# Altium schematic sheet Overview_sch.SchDoc
size A4; SheetNumber: 1; SheetTotal: 6
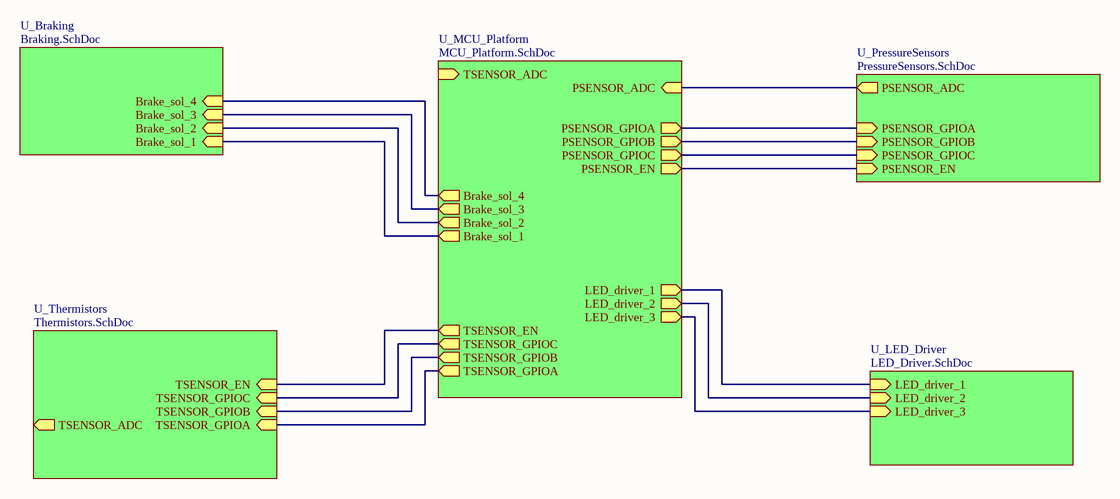
[diagram p0: Overview_sch.SchDoc]

## Sub-sheets
U_Braking = Braking.SchDoc: Brake_sol_1 (in), Brake_sol_2 (in), Brake_sol_3 (in), Brake_sol_4 (in)
U_LED_Driver = LED_Driver.SchDoc: LED_driver_1 (in), LED_driver_2 (in), LED_driver_3 (in)
U_MCU_Platform = MCU_Platform.SchDoc: TSENSOR_GPIOA (out), TSENSOR_GPIOB (out), TSENSOR_GPIOC (out), TSENSOR_EN (out), TSENSOR_ADC (in), PSENSOR_GPIOA (out), PSENSOR_GPIOB (out), PSENSOR_GPIOC (out), PSENSOR_EN (out), PSENSOR_ADC (in), LED_driver_1 (out), LED_driver_2 (out), LED_driver_3 (out), Brake_sol_1 (out), Brake_sol_2 (out), Brake_sol_3 (out), Brake_sol_4 (out)
U_PressureSensors = PressureSensors.SchDoc: PSENSOR_GPIOA (in), PSENSOR_GPIOB (in), PSENSOR_GPIOC (in), PSENSOR_EN (in), PSENSOR_ADC (out)
U_Thermistors = Thermistors.SchDoc: TSENSOR_GPIOA (in), TSENSOR_GPIOB (in), TSENSOR_GPIOC (in), TSENSOR_EN (in), TSENSOR_ADC (out)

## Nets
(unnamed): sheet U_Braking/Brake_sol_1, sheet U_MCU_Platform/Brake_sol_1
(unnamed): sheet U_Braking/Brake_sol_2, sheet U_MCU_Platform/Brake_sol_2
(unnamed): sheet U_Braking/Brake_sol_3, sheet U_MCU_Platform/Brake_sol_3
(unnamed): sheet U_Braking/Brake_sol_4, sheet U_MCU_Platform/Brake_sol_4
(unnamed): sheet U_LED_Driver/LED_driver_1, sheet U_MCU_Platform/LED_driver_1
(unnamed): sheet U_LED_Driver/LED_driver_2, sheet U_MCU_Platform/LED_driver_2
(unnamed): sheet U_LED_Driver/LED_driver_3, sheet U_MCU_Platform/LED_driver_3
(unnamed): sheet U_MCU_Platform/TSENSOR_GPIOA, sheet U_Thermistors/TSENSOR_GPIOA
(unnamed): sheet U_MCU_Platform/TSENSOR_GPIOB, sheet U_Thermistors/TSENSOR_GPIOB
(unnamed): sheet U_MCU_Platform/TSENSOR_GPIOC, sheet U_Thermistors/TSENSOR_GPIOC
(unnamed): sheet U_MCU_Platform/TSENSOR_EN, sheet U_Thermistors/TSENSOR_EN
(unnamed): sheet U_MCU_Platform/PSENSOR_GPIOA, sheet U_PressureSensors/PSENSOR_GPIOA
(unnamed): sheet U_MCU_Platform/PSENSOR_GPIOB, sheet U_PressureSensors/PSENSOR_GPIOB
(unnamed): sheet U_MCU_Platform/PSENSOR_GPIOC, sheet U_PressureSensors/PSENSOR_GPIOC
(unnamed): sheet U_MCU_Platform/PSENSOR_EN, sheet U_PressureSensors/PSENSOR_EN
(unnamed): sheet U_MCU_Platform/PSENSOR_ADC, sheet U_PressureSensors/PSENSOR_ADC